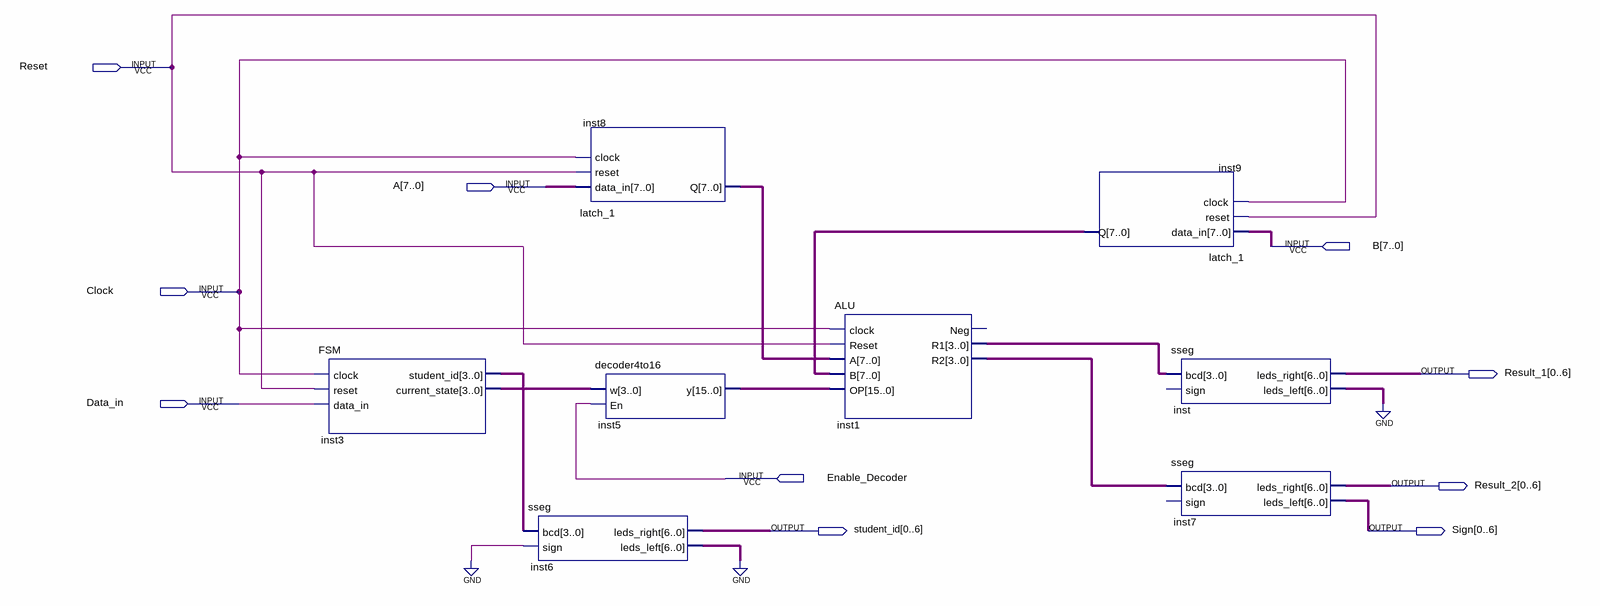
[diagram p0: schematic sheet]
// Quartus schematic ALUprob1.bdf as structural Verilog: 8 symbols, 10 pins
module ALUprob1 (
  input  Reset,
  input  [7:0] A,
  input  [7:0] B,
  input  Clock,
  input  Data_in,
  input  Enable_Decoder,
  output [0:6] Result_1,
  output [0:6] Result_2,
  output [0:6] student_id,
  output [0:6] Sign
);

  wire [3:0] inst1_r1, inst1_r2, inst3_current_state, inst3_student_id;
  wire [6:0] inst6_leds_left, inst_leds_left;
  wire [7:0] inst8_q, inst9_q;
  wire [15:0] inst5_y;

  FSM inst3 (
    .clock(Clock), .reset(Reset), .data_in(Data_in), .student_id(inst3_student_id),
    .current_state(inst3_current_state));
  sseg inst6 (.bcd(inst3_student_id), .sign(1'b0), .leds_right(student_id), .leds_left(inst6_leds_left));
  latch_1 inst8 (.data_in(A), .reset(Reset), .clock(Clock), .Q(inst8_q));
  decoder4to16 inst5 (.w(inst3_current_state), .En(Enable_Decoder), .y(inst5_y));
  ALU inst1 (
    .clock(Clock), .Reset(Reset), .A(inst8_q), .B(inst9_q), .OP(inst5_y), .R1(inst1_r1), .R2(inst1_r2));  // open: Neg
  latch_1 inst9 (.data_in(B), .reset(Reset), .clock(Clock), .Q(inst9_q));
  sseg inst (.bcd(inst1_r1), .leds_right(Result_1), .leds_left(inst_leds_left));  // open: sign
  sseg inst7 (.bcd(inst1_r2), .leds_right(Result_2), .leds_left(Sign));  // open: sign
  // also tied to GND on the sheet: {inst_leds_left[0], inst_leds_left[1], inst_leds_left[2], inst_leds_left[3], inst_leds_left[4], inst_leds_left[5], inst_leds_left[6], inst6_leds_left[0], inst6_leds_left[1], inst6_leds_left[2], inst6_leds_left[3], inst6_leds_left[4], inst6_leds_left[5], inst6_leds_left[6]}
endmodule
